# Altium schematic sheet 06_DIGITAL.SchDoc
size 420 x 297 mm; SheetNumber: 6; SheetTotal: 12
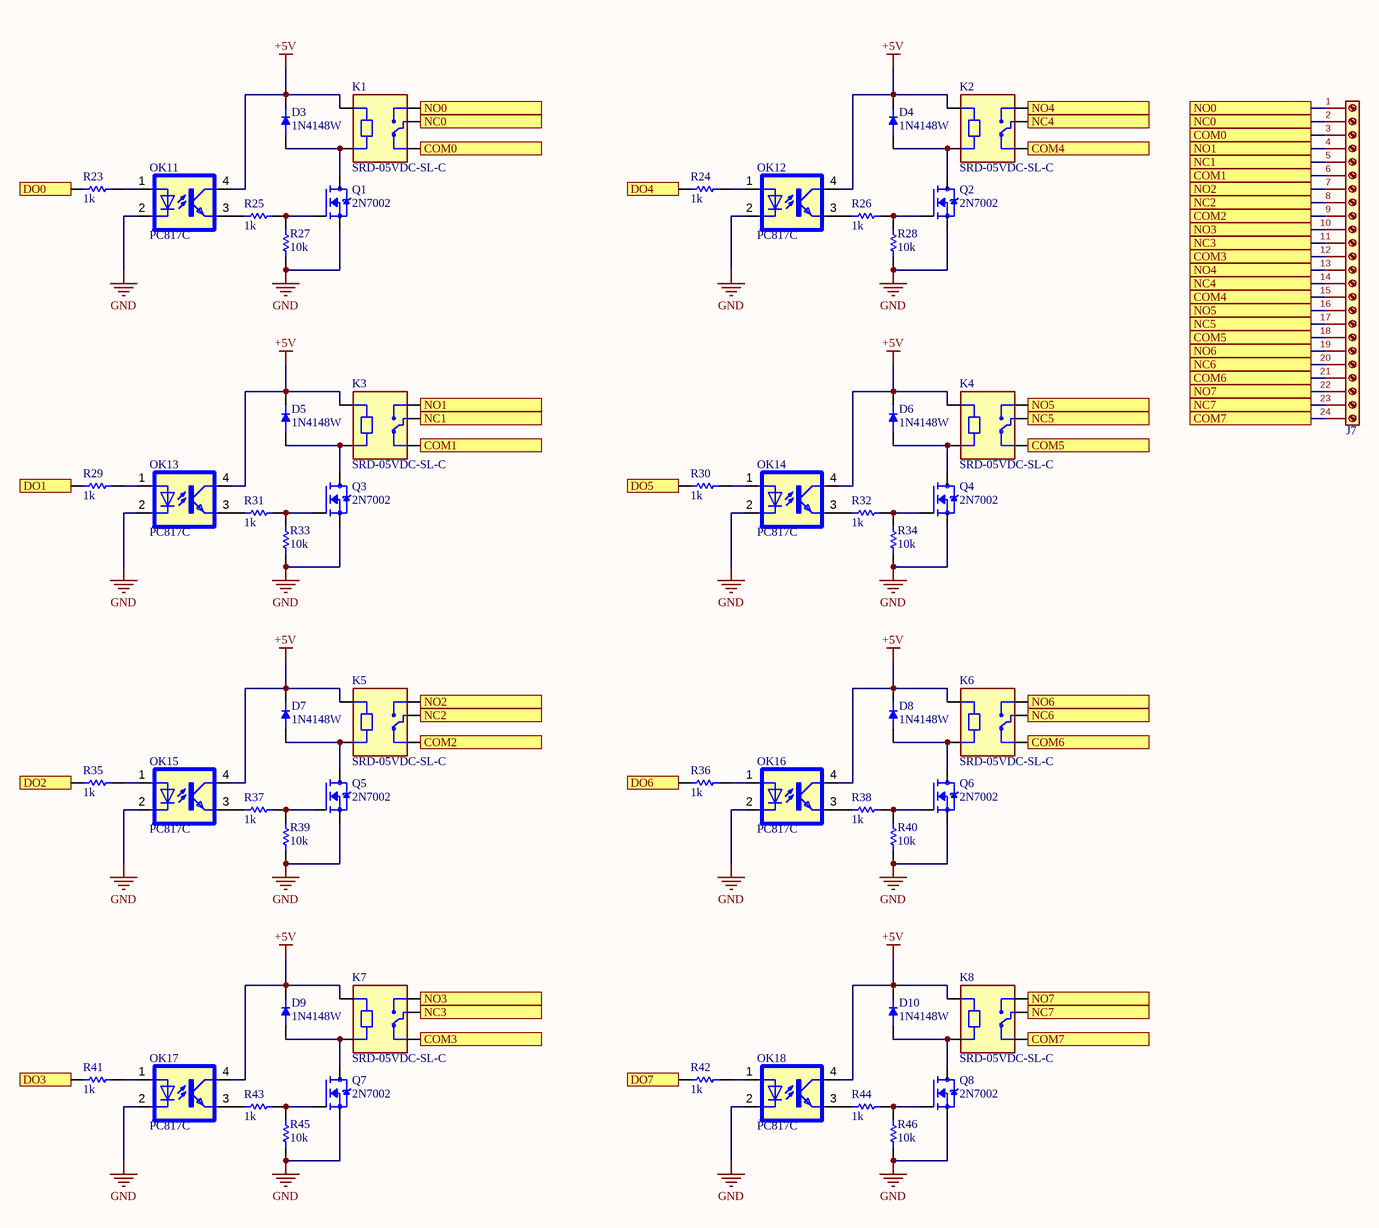
[diagram p0: 06_DIGITAL.SchDoc]

## Parts
D3  1N4148W  [SOD3715X135N]
D4  1N4148W  [SOD3715X135N]
D5  1N4148W  [SOD3715X135N]
D6  1N4148W  [SOD3715X135N]
D7  1N4148W  [SOD3715X135N]
D8  1N4148W  [SOD3715X135N]
D9  1N4148W  [SOD3715X135N]
D10  1N4148W  [SOD3715X135N]
J7  Terminal_01x24_P5.00  [TerminalBlock_Phoenix_PT-1,5-24-5.0-H_1x24_P5.00mm_Horizontal]  (value not drawn)
K1  SRD-05VDC-SL-C  [RELAY_SRD-05VDC-SL-C]
K2  SRD-05VDC-SL-C  [RELAY_SRD-05VDC-SL-C]
K3  SRD-05VDC-SL-C  [RELAY_SRD-05VDC-SL-C]
K4  SRD-05VDC-SL-C  [RELAY_SRD-05VDC-SL-C]
K5  SRD-05VDC-SL-C  [RELAY_SRD-05VDC-SL-C]
K6  SRD-05VDC-SL-C  [RELAY_SRD-05VDC-SL-C]
K7  SRD-05VDC-SL-C  [RELAY_SRD-05VDC-SL-C]
K8  SRD-05VDC-SL-C  [RELAY_SRD-05VDC-SL-C]
OK11  PC817C  [SOP254P975X460-4N]
OK12  PC817C  [SOP254P975X460-4N]
OK13  PC817C  [SOP254P975X460-4N]
OK14  PC817C  [SOP254P975X460-4N]
OK15  PC817C  [SOP254P975X460-4N]
OK16  PC817C  [SOP254P975X460-4N]
OK17  PC817C  [SOP254P975X460-4N]
OK18  PC817C  [SOP254P975X460-4N]
Q1  2N7002  [SOT95P240X111-3N]
Q2  2N7002  [SOT95P240X111-3N]
Q3  2N7002  [SOT95P240X111-3N]
Q4  2N7002  [SOT95P240X111-3N]
Q5  2N7002  [SOT95P240X111-3N]
Q6  2N7002  [SOT95P240X111-3N]
Q7  2N7002  [SOT95P240X111-3N]
Q8  2N7002  [SOT95P240X111-3N]
R23  ValueDisplayed: 1k  [0603]  (hidden comment: RES 10K 0603)
R24  ValueDisplayed: 1k  [0603]  (hidden comment: RES 10K 0603)
R25  ValueDisplayed: 1k  [0603]  (hidden comment: RES 10K 0603)
R26  ValueDisplayed: 1k  [0603]  (hidden comment: RES 10K 0603)
R27  ValueDisplayed: 10k  [0603]  (hidden comment: RES 10K 0603)
R28  ValueDisplayed: 10k  [0603]  (hidden comment: RES 10K 0603)
R29  ValueDisplayed: 1k  [0603]  (hidden comment: RES 10K 0603)
R30  ValueDisplayed: 1k  [0603]  (hidden comment: RES 10K 0603)
R31  ValueDisplayed: 1k  [0603]  (hidden comment: RES 10K 0603)
R32  ValueDisplayed: 1k  [0603]  (hidden comment: RES 10K 0603)
R33  ValueDisplayed: 10k  [0603]  (hidden comment: RES 10K 0603)
R34  ValueDisplayed: 10k  [0603]  (hidden comment: RES 10K 0603)
R35  ValueDisplayed: 1k  [0603]  (hidden comment: RES 10K 0603)
R36  ValueDisplayed: 1k  [0603]  (hidden comment: RES 10K 0603)
R37  ValueDisplayed: 1k  [0603]  (hidden comment: RES 10K 0603)
R38  ValueDisplayed: 1k  [0603]  (hidden comment: RES 10K 0603)
R39  ValueDisplayed: 10k  [0603]  (hidden comment: RES 10K 0603)
R40  ValueDisplayed: 10k  [0603]  (hidden comment: RES 10K 0603)
R41  ValueDisplayed: 1k  [0603]  (hidden comment: RES 10K 0603)
R42  ValueDisplayed: 1k  [0603]  (hidden comment: RES 10K 0603)
R43  ValueDisplayed: 1k  [0603]  (hidden comment: RES 10K 0603)
R44  ValueDisplayed: 1k  [0603]  (hidden comment: RES 10K 0603)
R45  ValueDisplayed: 10k  [0603]  (hidden comment: RES 10K 0603)
R46  ValueDisplayed: 10k  [0603]  (hidden comment: RES 10K 0603)

## Ports
COM0 (see 06_DIGITAL[2A]), COM0 (see 06_DIGITAL[4A]), COM1 (see 06_DIGITAL[2B]), COM1 (see 06_DIGITAL[4A]), COM2 (see 06_DIGITAL[2B]), COM2 (see 06_DIGITAL[4A]), COM3 (see 06_DIGITAL[2C]), COM3 (see 06_DIGITAL[4A]), COM4 (see 06_DIGITAL[3A]), COM4 (see 06_DIGITAL[4A]), COM5 (see 06_DIGITAL[3B]), COM5 (see 06_DIGITAL[4A]), COM6 (see 06_DIGITAL[3B]), COM6 (see 06_DIGITAL[4A]), COM7 (see 06_DIGITAL[3C]), COM7 (see 06_DIGITAL[4B]), DO0 (see 04_STM32F303VCT6[5B]), DO1 (see 04_STM32F303VCT6[5B]), DO2 (see 04_STM32F303VCT6[5B]), DO3 (see 04_STM32F303VCT6[5B]), DO4 (see 04_STM32F303VCT6[3B]), DO5 (see 04_STM32F303VCT6[3B]), DO6 (see 04_STM32F303VCT6[3B]), DO7 (see 04_STM32F303VCT6[3B]), NC0 (see 06_DIGITAL[2A]), NC0 (see 06_DIGITAL[4A]), NC1 (see 06_DIGITAL[2B]), NC1 (see 06_DIGITAL[4A]), NC2 (see 06_DIGITAL[2B]), NC2 (see 06_DIGITAL[4A]), NC3 (see 06_DIGITAL[2C]), NC3 (see 06_DIGITAL[4A]), NC4 (see 06_DIGITAL[3A]), NC4 (see 06_DIGITAL[4A]), NC5 (see 06_DIGITAL[3B]), NC5 (see 06_DIGITAL[4A]), NC6 (see 06_DIGITAL[3B]), NC6 (see 06_DIGITAL[4A]), NC7 (see 06_DIGITAL[3C]), NC7 (see 06_DIGITAL[4B]), NO0 (see 06_DIGITAL[2A]), NO0 (see 06_DIGITAL[4A]), NO1 (see 06_DIGITAL[2B]), NO1 (see 06_DIGITAL[4A]), NO2 (see 06_DIGITAL[2B]), NO2 (see 06_DIGITAL[4A]), NO3 (see 06_DIGITAL[2C]), NO3 (see 06_DIGITAL[4A]), NO4 (see 06_DIGITAL[3A]), NO4 (see 06_DIGITAL[4A]), NO5 (see 06_DIGITAL[3B]), NO5 (see 06_DIGITAL[4A]), NO6 (see 06_DIGITAL[3B]), NO6 (see 06_DIGITAL[4A]), NO7 (see 06_DIGITAL[3C]), NO7 (see 06_DIGITAL[4A])

## Nets
+5V: D3.C(K) D4.C(K) D5.C(K) D6.C(K) D7.C(K) D8.C(K) D9.C(K) D10.C(K) K1.A1 K2.A1 K3.A1 K4.A1 K5.A1 K6.A1 K7.A1 K8.A1 OK11.4(COL) OK12.4(COL) OK13.4(COL) OK14.4(COL) OK15.4(COL) OK16.4(COL) OK17.4(COL) OK18.4(COL)
GND: OK11.2(C) OK12.2(C) OK13.2(C) OK14.2(C) OK15.2(C) OK16.2(C) OK17.2(C) OK18.2(C) Q1.2(S) Q2.2(S) Q3.2(S) Q4.2(S) Q5.2(S) Q6.2(S) Q7.2(S) Q8.2(S) R27.2 R28.2 R33.2 R34.2 R39.2 R40.2 R45.2 R46.2
COM0: J7.3(Pin_3) K1.NC ; port COM0
COM1: J7.6(Pin_6) K3.NC ; port COM1
COM2: J7.9(Pin_9) K5.NC ; port COM2
COM3: J7.12(Pin_12) K7.NC ; port COM3
COM4: J7.15(Pin_15) K2.NC ; port COM4
COM5: J7.18(Pin_18) K4.NC ; port COM5
COM6: J7.21(Pin_21) K6.NC ; port COM6
COM7: J7.24(Pin_24) K8.NC ; port COM7
DO0: R23.2 ; port DO0
DO1: R29.2 ; port DO1
DO2: R35.2 ; port DO2
DO3: R41.2 ; port DO3
DO4: R24.2 ; port DO4
DO5: R30.2 ; port DO5
DO6: R36.2 ; port DO6
DO7: R42.2 ; port DO7
NC0: J7.2(Pin_2) K1.COM ; port NC0
NC1: J7.5(Pin_5) K3.COM ; port NC1
NC2: J7.8(Pin_8) K5.COM ; port NC2
NC3: J7.11(Pin_11) K7.COM ; port NC3
NC4: J7.14(Pin_14) K2.COM ; port NC4
NC5: J7.17(Pin_17) K4.COM ; port NC5
NC6: J7.20(Pin_20) K6.COM ; port NC6
NC7: J7.23(Pin_23) K8.COM ; port NC7
NO0: J7.1(Pin_1) K1.NO ; port NO0
NO1: J7.4(Pin_4) K3.NO ; port NO1
NO2: J7.7(Pin_7) K5.NO ; port NO2
NO3: J7.10(Pin_10) K7.NO ; port NO3
NO4: J7.13(Pin_13) K2.NO ; port NO4
NO5: J7.16(Pin_16) K4.NO ; port NO5
NO6: J7.19(Pin_19) K6.NO ; port NO6
NO7: J7.22(Pin_22) K8.NO ; port NO7
NetD3_A: D3.A K1.A2 Q1.3(D)
NetD4_A: D4.A K2.A2 Q2.3(D)
NetD5_A: D5.A K3.A2 Q3.3(D)
NetD6_A: D6.A K4.A2 Q4.3(D)
NetD7_A: D7.A K5.A2 Q5.3(D)
NetD8_A: D8.A K6.A2 Q6.3(D)
NetD9_A: D9.A K7.A2 Q7.3(D)
NetD10_A: D10.A K8.A2 Q8.3(D)
NetOK11_1: OK11.1(A) R23.1
NetOK11_3: OK11.3(EMIT) R25.2
NetOK12_1: OK12.1(A) R24.1
NetOK12_3: OK12.3(EMIT) R26.2
NetOK13_1: OK13.1(A) R29.1
NetOK13_3: OK13.3(EMIT) R31.2
NetOK14_1: OK14.1(A) R30.1
NetOK14_3: OK14.3(EMIT) R32.2
NetOK15_1: OK15.1(A) R35.1
NetOK15_3: OK15.3(EMIT) R37.2
NetOK16_1: OK16.1(A) R36.1
NetOK16_3: OK16.3(EMIT) R38.2
NetOK17_1: OK17.1(A) R41.1
NetOK17_3: OK17.3(EMIT) R43.2
NetOK18_1: OK18.1(A) R42.1
NetOK18_3: OK18.3(EMIT) R44.2
NetQ1_1: Q1.1(G) R25.1 R27.1
NetQ2_1: Q2.1(G) R26.1 R28.1
NetQ3_1: Q3.1(G) R31.1 R33.1
NetQ4_1: Q4.1(G) R32.1 R34.1
NetQ5_1: Q5.1(G) R37.1 R39.1
NetQ6_1: Q6.1(G) R38.1 R40.1
NetQ7_1: Q7.1(G) R43.1 R45.1
NetQ8_1: Q8.1(G) R44.1 R46.1

## Notes on the sheet
- Sub-system:
- Project:
- Design by:
- Sheet title:
- Sheet
- of
- Checked by:
- Approved by:
- Doc No:
- Revision:
- Size:
- Date:
- A3

## Library data of the parts
D3-D10 = 1N4148W: Diode Standard 100 V 300mA (DC) Surface Mount SOD-123; MF: Diodes Inc.; MP: 1N4148W-7; SnapEDA_Link: https://www.snapeda.com/parts/1N4148W-7/Diodes+Inc./view-part/?ref=snap; Package: SOD-123 Fairchild Semiconductor; Value: *; Check_prices: https://www.snapeda.com/parts/1N4148W-7/Diodes+Inc./view-part/?ref=eda
K1-K8 = SRD-05VDC-SL-C: 5V Trigger Relay Module For Arduino And Raspberry Pi 5V Trigger Relay Module For Arduino And Raspberry Pi; MF: Songle Relay; Check_prices: https://www.snapeda.com/parts/SRD-05VDC-SL-C/Songle+Relay/view-part/?ref=eda; Value: *; Availability: Not in stock; Price: None; Package: NON STANDARD-5 Songle Relay; MP: SRD-05VDC-SL-C; SnapEDA_Link: https://www.snapeda.com/parts/SRD-05VDC-SL-C/Songle+Relay/view-part/?ref=snap
OK11-OK18 = PC817C: RF Mixer IC Cellular, DCS, PCS, W-CDMA, WLAN Up Converter 50MHz ~ 400MHz 6-SuperMiniMold; MF: Renesas Electronics America Inc; MP: PC817; SnapEDA_Link: https://www.snapeda.com/parts/PC817/Renesas/view-part/?ref=snap; Package: None; Value: *; Check_prices: https://www.snapeda.com/parts/PC817/Renesas/view-part/?ref=eda
Q1-Q8 = 2N7002: Mosfet Array 2 N-Channel (Dual) 60V 300mA 500mW Surface Mount PG-SOT363-6; MF: onsemi; SnapEDA_Link: https://www.snapeda.com/parts/2N7002/Onsemi/view-part/?ref=snap; Package: SOT-23-3 ON Semiconductor; Value: *; MP: 2N7002; Check_prices: https://www.snapeda.com/parts/2N7002/Onsemi/view-part/?ref=eda
R23-R46 = RES 10K 0603 1%: RES, 10K, 1%, 0.1 W, AEC-Q200 Grade 0, 0603; Manufacturer: Vishay-Dale; PartNumber: CRCW060320R0JNEA; Power_W: 100mW; TempCo: 200 ppm/C; Value_Code: 20R0; Value1: 5%; Value: 20; EIA_Code: E24; SizeX_mm: 1.6; SizeY_mm: 0.8; SizeZ_mm: 1; Value2: 0.1W; SizeArea_mm2: 1.28; CompType: Resistor; AEC Qualified: Y; VDC_V: 75V; AEC Category: Q200; AEC Grade: 0; Supplier Part Number 2: 59M6784; Supplier 2: Newark; Supplier Part Number 3: 71-CRCW0603J-20-E3; Supplier 3: Mouser; RoHS: E; MountType: SMT; Supplier 1: Digi-Key; PackageReference: 0603; Tolerance_%: 5%; Res_ohm: 20; ComponentLink1Description: Datasheet link; Supplier Part Number 1: 541-20GCT-ND; Technology: Thick Film; ComponentLink1URL: http://www.vishay.com/docs/20035/dcrcwe3.pdf